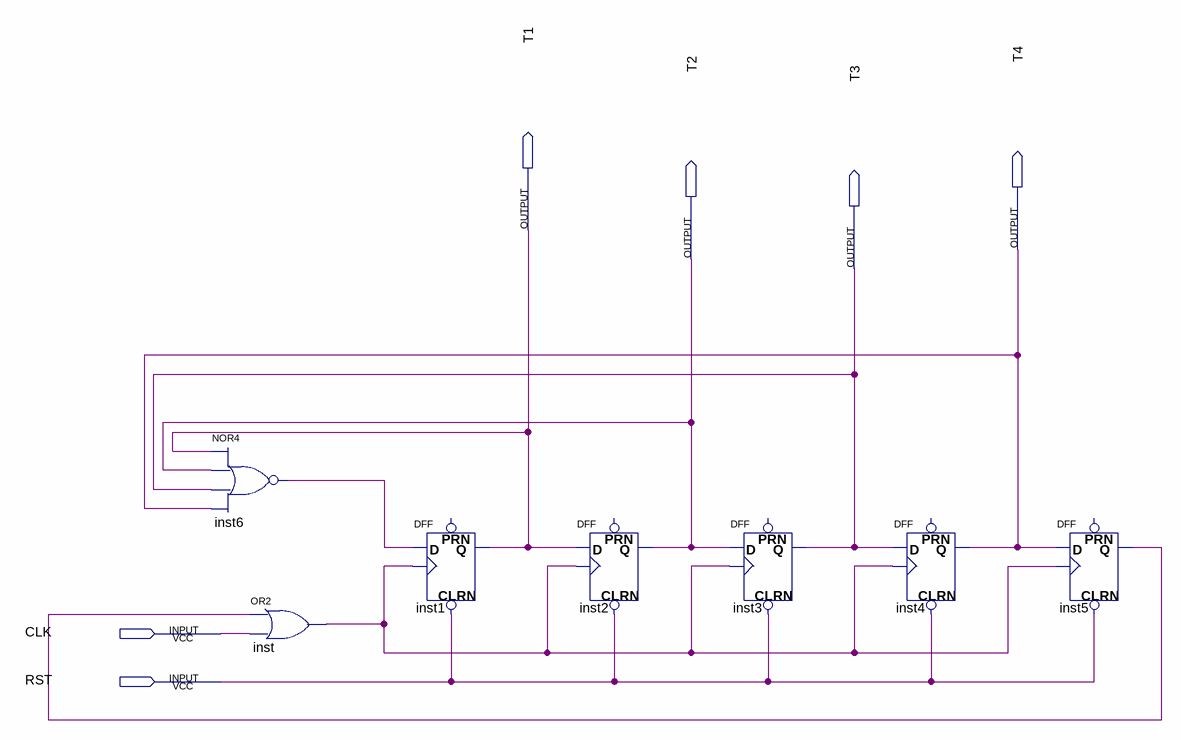
[diagram p0: schematic sheet]
// Quartus schematic exp11-2.bdf as structural Verilog: 7 symbols, 6 pins
module \exp11-2  (
  input  CLK,
  input  RST,
  output T1,
  output T4,
  output T2,
  output T3
);

  wire inst5_q, inst6_out, inst_out;

  nor inst6 (inst6_out, T1, T2, T3, T4);
  or inst (inst_out, inst5_q, CLK);
  DFF inst1 (.CLRN(RST), .CLK(inst_out), .D(inst6_out), .Q(T1));  // open: PRN
  DFF inst2 (.CLRN(RST), .CLK(inst_out), .D(T1), .Q(T2));  // open: PRN
  DFF inst3 (.CLRN(RST), .CLK(inst_out), .D(T2), .Q(T3));  // open: PRN
  DFF inst4 (.CLRN(RST), .CLK(inst_out), .D(T3), .Q(T4));  // open: PRN
  DFF inst5 (.CLRN(RST), .CLK(inst_out), .D(T4), .Q(inst5_q));  // open: PRN
endmodule
